# Altium project LVPM.PrjPcb
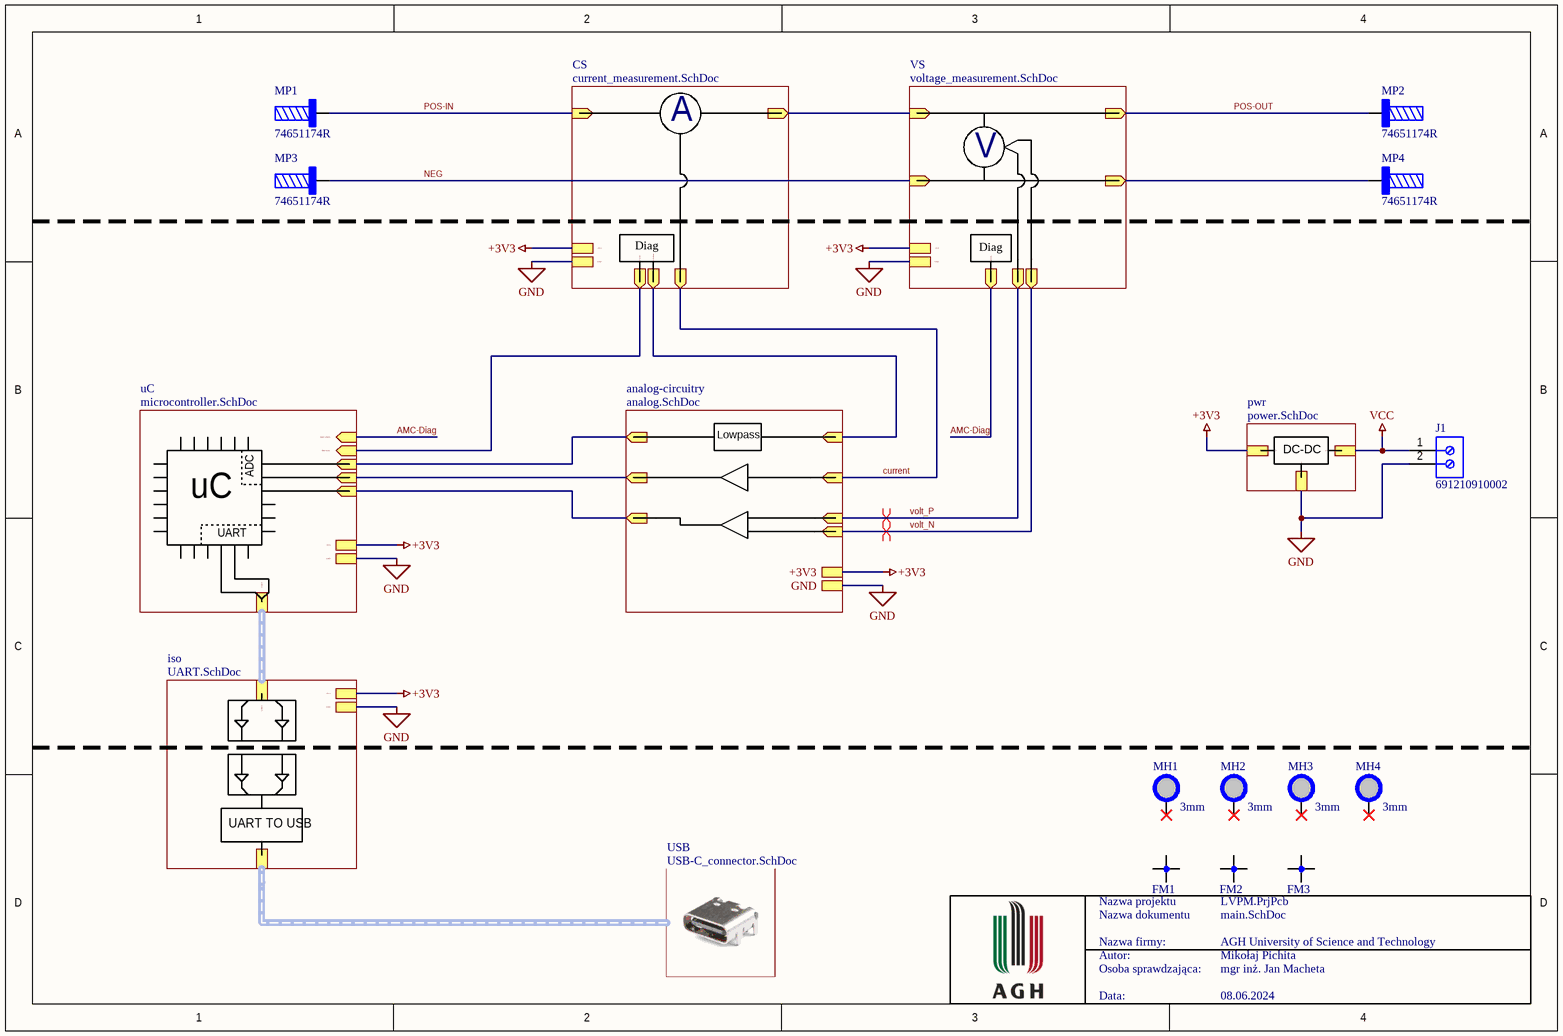
[diagram p0: main.SchDoc]
8 sheets, 108 parts. Net scope: strictly hierarchical (ports join the sheet entries above them; power ports are local).
Board file: PCB1.PcbDoc
Sheets:
  main.SchDoc
    CS = current_measurement.SchDoc
    VS = voltage_measurement.SchDoc
    uC = microcontroller.SchDoc
    iso = UART.SchDoc
    pwr = power.SchDoc
    USB = USB-C_connector.SchDoc
    analog-circuitry = analog.SchDoc

## Sheet main.SchDoc
size A4; Date: 08.06.2024; ApprovedBy: mgr inż. Jan Macheta; Author: Mikołaj Pichita; CompanyName: AGH University of Science and Technology; SheetNumber: 1; SheetTotal: 8

### Parts
FM1  *  [FIDUCIAL_MARKER]  (value not drawn)
FM2  *  [FIDUCIAL_MARKER]  (value not drawn)
FM3  *  [FIDUCIAL_MARKER]  (value not drawn)
J1  691210910002  [691210910002]
MH1  3mm  [MountingHole]  (no BOM)
MH2  3mm  [MountingHole]  (no BOM)
MH3  3mm  [MountingHole]  (no BOM)
MH4  3mm  [MountingHole]  (no BOM)
MP1  74651174R  [74651174]
MP2  74651174R  [74651174]
MP3  74651174R  [74651174]
MP4  74651174R  [74651174]

### Sub-sheets
analog-circuitry = analog.SchDoc: +3V3, GND, Voltage (out), Current (out), Alert-Filtered (out), TMCS-Alert (in), v_P (in), v_N (in), sensor_current (in)
CS = current_measurement.SchDoc: +IN (in), +OUT (out), GND, current (out), +3V3, TMCS-OC (out), TMCS-Alert (out)
iso = UART.SchDoc: UART (harness UART), USB (harness *), +3V3, GND
pwr = power.SchDoc: VCC, GND, +3V3
uC = microcontroller.SchDoc: GND, +3V3, AMC-DIAG (in), UART (harness UART), ADC-IN7 (in), ADC-IN9 (in), ADC-IN0 (in), TMCS-OC (in)
USB = USB-C_connector.SchDoc: USB (harness *)
VS = voltage_measurement.SchDoc: +IN (in), -IN (in), +OUT (out), -OUT (out), GND, +3V3, voltageP (out), voltageN (out), diagnostic (out)

### Nets
+3V3: sheet CS/+3V3, sheet VS/+3V3, sheet uC/+3V3, sheet iso/+3V3, sheet pwr/+3V3, sheet analog-circuitry/+3V3
GND: J1.2 ; sheet CS/GND, sheet VS/GND, sheet uC/GND, sheet iso/GND, sheet pwr/GND, sheet analog-circuitry/GND
VCC: J1.1 ; sheet pwr/VCC
Alert: sheet CS/TMCS-Alert, sheet analog-circuitry/TMCS-Alert
Alert-Fltr: sheet uC/ADC-IN0, sheet analog-circuitry/Alert-Filtered
AMC-Diag: sheet VS/diagnostic, sheet uC/AMC-DIAG
current: sheet CS/current, sheet analog-circuitry/sensor_current
in-curr: sheet uC/ADC-IN7, sheet analog-circuitry/Current
in-volt: sheet uC/ADC-IN9, sheet analog-circuitry/Voltage
NEG: MP3.1 MP4.1 ; sheet VS/-IN, sheet VS/-OUT
OC: sheet CS/TMCS-OC, sheet uC/TMCS-OC
POS-IN: MP1.1 ; sheet CS/+IN
POS-OUT: MP2.1 ; sheet CS/+OUT, sheet VS/+IN, sheet VS/+OUT
volt_N: sheet VS/voltageN, sheet analog-circuitry/v_N
volt_P: sheet VS/voltageP, sheet analog-circuitry/v_P

Not connected (* = marked no-connect by the designer): MH1 1*; MH2 1*; MH3 1*; MH4 1*

### Buses and harness runs
harness sheet iso/UART = sheet uC/UART
harness sheet iso/USB = sheet USB/USB

### Layout directives
differential pair: volt_N, volt_P

### Notes on the sheet
- A
- V
- Diag
- Lowpass
- uC
- ADC
- DC-DC
- UART
- UART TO USB
- Nazwa projektu
- Nazwa dokumentu
- Nazwa firmy:
- Autor:
- Osoba sprawdzająca:
- Data:

### Library data of the parts
FM1-FM3 = Fiducial marker: Value: *; HelpURL: *; MPN: *; Supplier: *; SupplierPartNumber: *
J1 = 691210910002: NexarPartId: 105950649; Current Rating: 6A; Voltage Rating: 150V; Number of Contacts: 2; Number of Rows: 1; Contact Material: Tin; Height: 8.7mm; Max Operating Temperature: 105°C; Min Operating Temperature: -40°C
MH1-MH4 = Mounting hole: Value: *; HelpURL: *; MPN: *; Supplier: *; SupplierPartNumber: *
MP1-MP4 = 74651174R: 74651174R Shank, THR, external thread, 7mm W x 8.5mm H, M4, 4 Pins | Wurth Electronics 74651174R; NexarPartId: 78872243; Current Rating: 50A; Material: Brass; Packaging: Tape and Reel; Height: 8.5mm; Max Operating Temperature: 150°C; RoHS: Compliant; Width: 7mm; Min Operating Temperature: -55°C; Number of Pins: 4

## Sheet current_measurement.SchDoc
size A4; Date: 08.06.2024; ApprovedBy: Jan Macheta; Author: Mikołaj Pichita; SheetNumber: 2; SheetTotal: 8
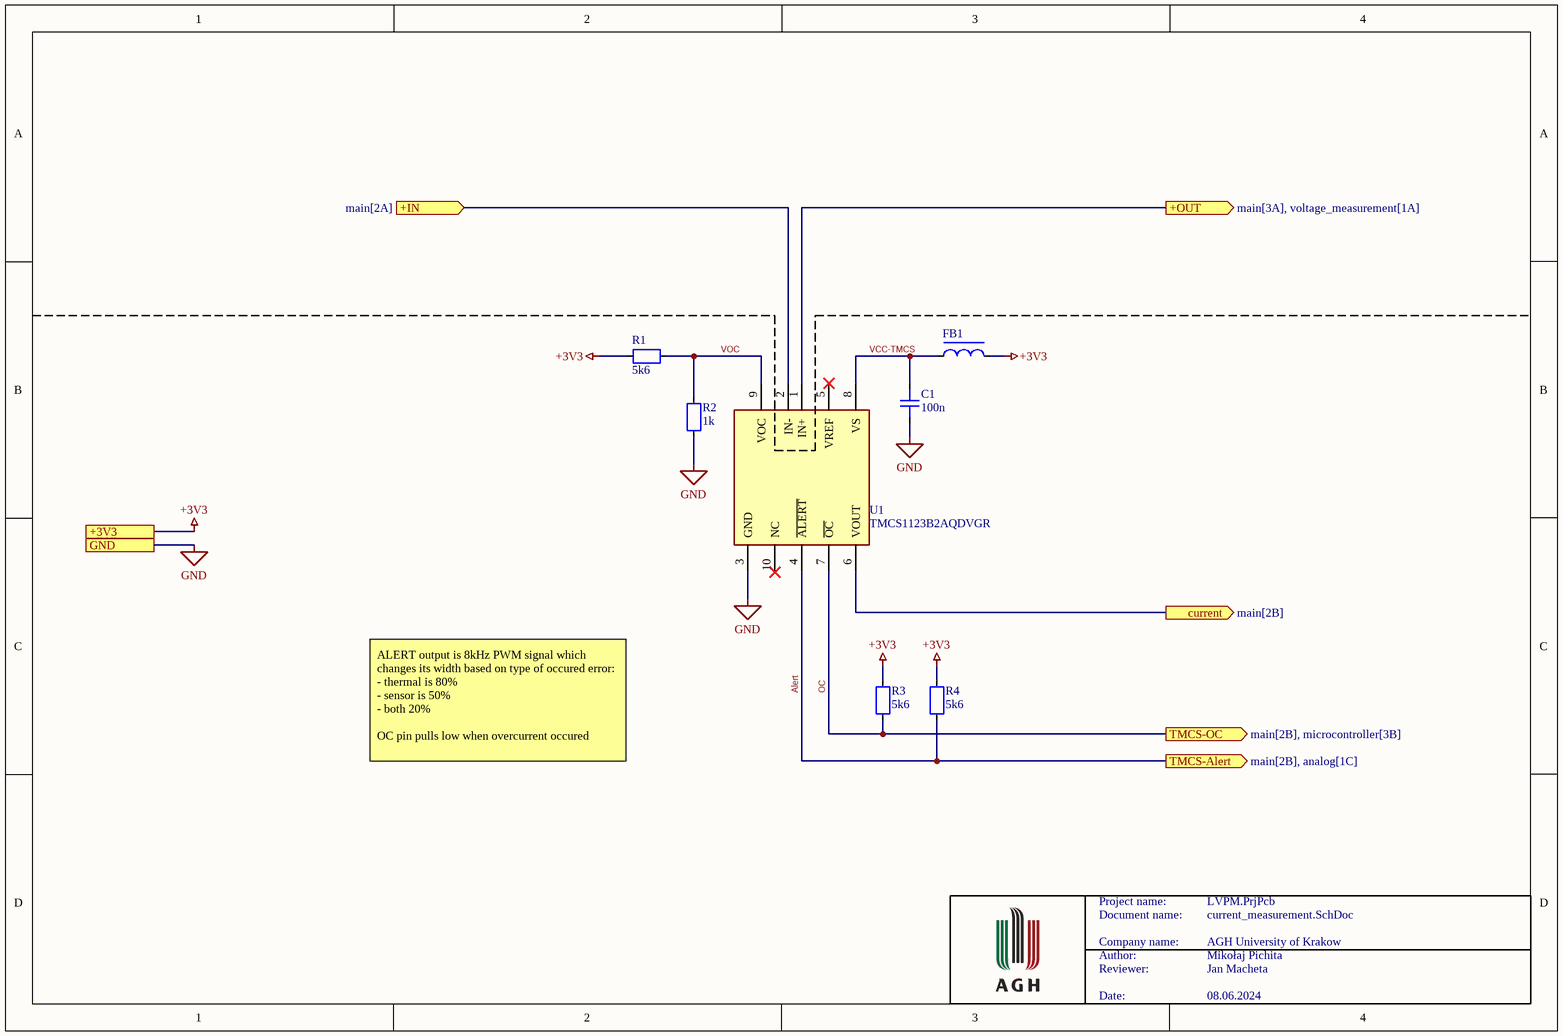
[diagram p1: current_measurement.SchDoc]

### Parts
C1  100n  [CAP0603]
FB1  *  [FB0402]  (value not drawn)
R1  5k6  [RES0603]
R2  1k  [RES0603]
R3  5k6  [RES0603]
R4  5k6  [RES0603]
U1  TMCS1123B2AQDVGR  [FP-DVG0010A-MFG]

### Ports
+3V3 (see main[2A], analog[4A], microcontroller[4A], power[2A], UART[1A], voltage_measurement[4D]), +IN (in, see main[2A]), +OUT (out, see main[3A], voltage_measurement[1A]), current (out, see main[2B]), GND (see main[2B], analog[4A], microcontroller[4A], power[2B], UART[1A], voltage_measurement[4D]), TMCS-Alert (out, see main[2B], analog[1C]), TMCS-OC (out, see main[2B], microcontroller[3B])

### Nets
+3V3: FB1.2 R1.2 R3.1 R4.1 ; port +3V3
GND: C1.2 R2.2 U1.3(GND) ; port GND
Alert: R4.2 U1.4(~{ALERT}) ; port TMCS-Alert
current: U1.6(VOUT) ; port current
OC: R3.2 U1.7(~{OC}) ; port TMCS-OC
POS-IN: U1.2(IN-) ; port +IN
POS-OUT: U1.1(IN+) ; port +OUT
VCC-TMCS: C1.1 FB1.1 U1.8(VS)
VOC: R1.1 R2.1 U1.9(VOC)

Not connected (* = marked no-connect by the designer): U1 5(VREF)* 10(NC)*

### Notes on the sheet
- ALERT output is 8kHz PWM signal which changes its width based on type of occured error:
  - thermal is 80%
  - sensor is 50%
  - both 20%
  OC pin pulls low when overcurrent occured
- Project name:
- Document name:
- Company name:
- Author:
- Reviewer:
- AGH University of Krakow
- Date:

### Library data of the parts
C1 = Capacitor: Value: *; HelpURL: *; MPN: *; Supplier: *; SupplierPartNumber: *
FB1 = Ferrite Bead: Value: *; HelpURL: *; MPN: *; Supplier: *; SupplierPartNumber: *
R1-R4 = Resistor: Value: *; HelpURL: *; MPN: *; Supplier: *; SupplierPartNumber: *
U1 = TMCS1123B2AQDVGR: TMCS1123B2AQDVGR ±1300V reinforced isolation, 80Arms 250kHz Hall-effect current sensor with AFR, reference and ALERT 10-SOIC -40 to 125; NexarPartId: 145718629; Manufacturer Lifecycle Status: ACTIVE; Max Junction Temperature (Tj): 165°C; Max Supply Voltage: 5.5V; Operating Supply Current: 11mA; Sensing Method: Hall Effect; Coil Resistance: 700µΩ; Min Supply Voltage: 3V; Accuracy: 0.1%; Lifecycle Status: Production; Height: 0m; Length: 10.3mm; Number of Pins: 10; Min Operating Temperature: -40°C; Thickness: 2.35mm; Width: 7.5mm; Case/Package: SOIC; Max Operating Temperature: 125°C; Ambient Temperature Range High: 125°C

## Sheet voltage_measurement.SchDoc
size A4; Date: 08.06.2024; ApprovedBy: Jan Macheta; Author: Mikołaj Pichita; SheetNumber: 3; SheetTotal: 8
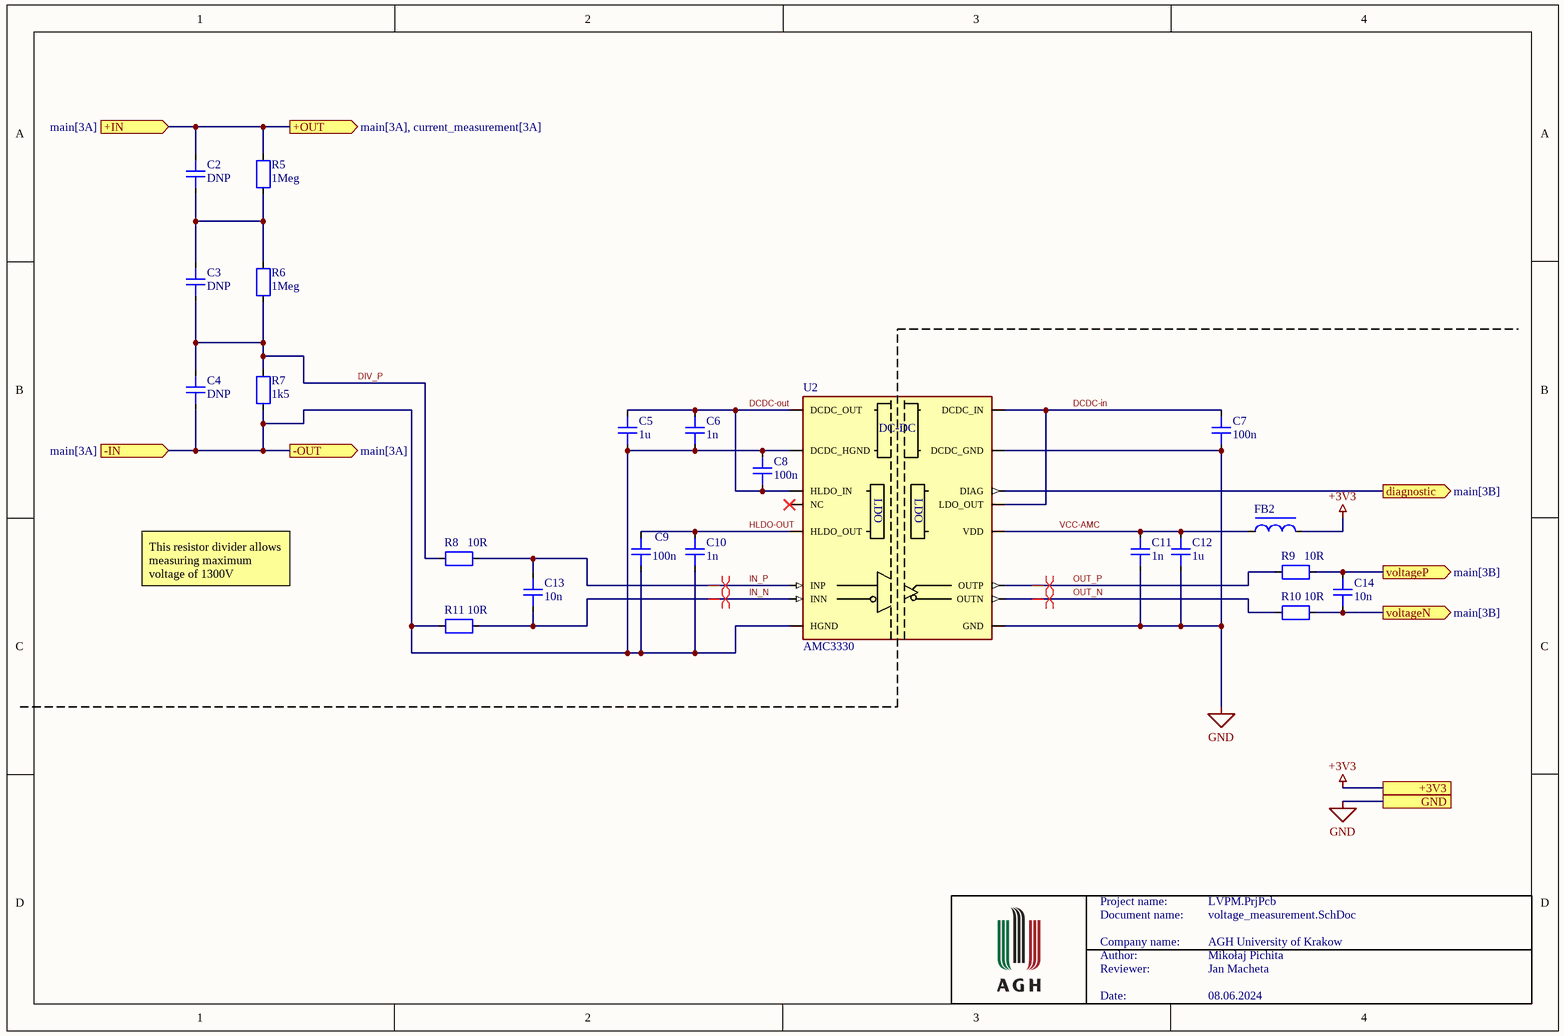
[diagram p2: voltage_measurement.SchDoc]

### Parts
C2  DNP  [CAP1206]
C3  DNP  [CAP1206]
C4  DNP  [CAP1206]
C5  1u  [CAP0603]
C6  1n  [CAP0603]
C7  100n  [CAP0603]
C8  100n  [CAP0603]
C9  100n  [CAP1206]
C10  1n  [CAP1206]
C11  1n  [CAP1206]
C12  1u  [CAP1206]
C13  10n  [CAP0603]
C14  10n  [CAP0603]
FB2  *  [FB0402]  (value not drawn)
R5  1Meg  [RESC3215X06N]
R6  1Meg  [RESC3215X06N]
R7  1k5  [RESC3215X06N]
R8  10R  [RES0603]
R9  10R  [RES0603]
R10  10R  [RES0603]
R11  10R  [RES0603]
U2  AMC3330  [SOIC127P1030X265-16N]

### Ports
+3V3 (see main[3A], analog[4A], current_measurement[1C], microcontroller[4A], power[2A], UART[1A]), +IN (in, see main[3A]), +OUT (out, see main[3A], current_measurement[3A]), -IN (in, see main[3A]), -OUT (out, see main[3A]), diagnostic (out, see main[3B]), GND (see main[3B], analog[4A], current_measurement[1C], microcontroller[4A], power[2B], UART[1A]), voltageN (out, see main[3B]), voltageP (out, see main[3B])

### Nets
+3V3: FB2.2 ; port +3V3
GND: C7.2 C11.2 C12.2 U2.9(GND) U2.15(DCDC_GND) ; port GND
AMC-Diag: U2.14(DIAG) ; port diagnostic
DCDC-in: C7.1 U2.13(LDO_OUT) U2.16(DCDC_IN)
DCDC-out: C5.1 C6.1 C8.2 U2.1(DCDC_OUT) U2.3(HLDO_IN)
DIV_P: C3.2 C4.1 R6.2 R7.1 R8.1
HLDO-OUT: C9.1 C10.1 U2.5(HLDO_OUT)
IN_N: C13.2 R11.2 U2.7(INN)
IN_P: C13.1 R8.2 U2.6(INP)
NEG: C4.2 C5.2 C6.2 C8.1 C9.2 C10.2 R7.2 R11.1 U2.2(DCDC_HGND) U2.8(HGND) ; port -IN, port -OUT
OUT_N: R10.2 U2.10(OUTN)
OUT_P: R9.2 U2.11(OUTP)
POS-OUT: C2.1 R5.1 ; port +IN, port +OUT
VCC-AMC: C11.1 C12.1 FB2.1 U2.12(VDD)
volt_N: C14.1 R10.1 ; port voltageN
volt_P: C14.2 R9.1 ; port voltageP
NetC2_2: C2.2 C3.1 R5.2 R6.1

Not connected (* = marked no-connect by the designer): U2 4(NC)*

### Layout directives
differential pair: IN_N, IN_P, OUT_N, OUT_P

### Notes on the sheet
- This resistor divider allows measuring maximum voltage of 1300V
- Project name:
- Document name:
- Company name:
- Author:
- Reviewer:
- AGH University of Krakow
- Date:
- (in symbol AMC3330) DC-DC; LDO

### Library data of the parts
C2-C14 = Capacitor: Value: *; HelpURL: *; MPN: *; Supplier: *; SupplierPartNumber: *
  C5 C12: Supplier 1: Mouser; Supplier Part Number 1: 581-12065C105K4Z4A
  C6 C10: Supplier 1: Mouser; Supplier Part Number 1: 581-0603YC102J4T2A
  C7-C9: Supplier 1: Mouser; Supplier Part Number 1: 581-06035C104KAT2A
  C11: Supplier 1: Mouser; Supplier Part Number 1: 581-1206GC102KAT3A
  C14: Supplier 1: Mouser; Supplier Part Number 1: 581-06035C103K
FB2 = Ferrite Bead: Value: *; HelpURL: *; MPN: *; Supplier: *; SupplierPartNumber: *
R5-R11 = Resistor: Value: *; HelpURL: *; MPN: *; Supplier: *; SupplierPartNumber: *
  R9 R10: Supplier 1: Mouser; Supplier Part Number 1: 603-RP0603BRD0710RL
U2 = AMC3330: ±1-V input, precision voltage sensing reinforced isolated amplifier with integrated DC/DC; Value: *; HelpURL: *; MPN: *; Supplier: *; SupplierPartNumber: *

## Sheet microcontroller.SchDoc
size A4; Date: 08.06.2024; ApprovedBy: Jan Macheta; Author: Mikołaj Pichita; SheetNumber: 5; SheetTotal: 8
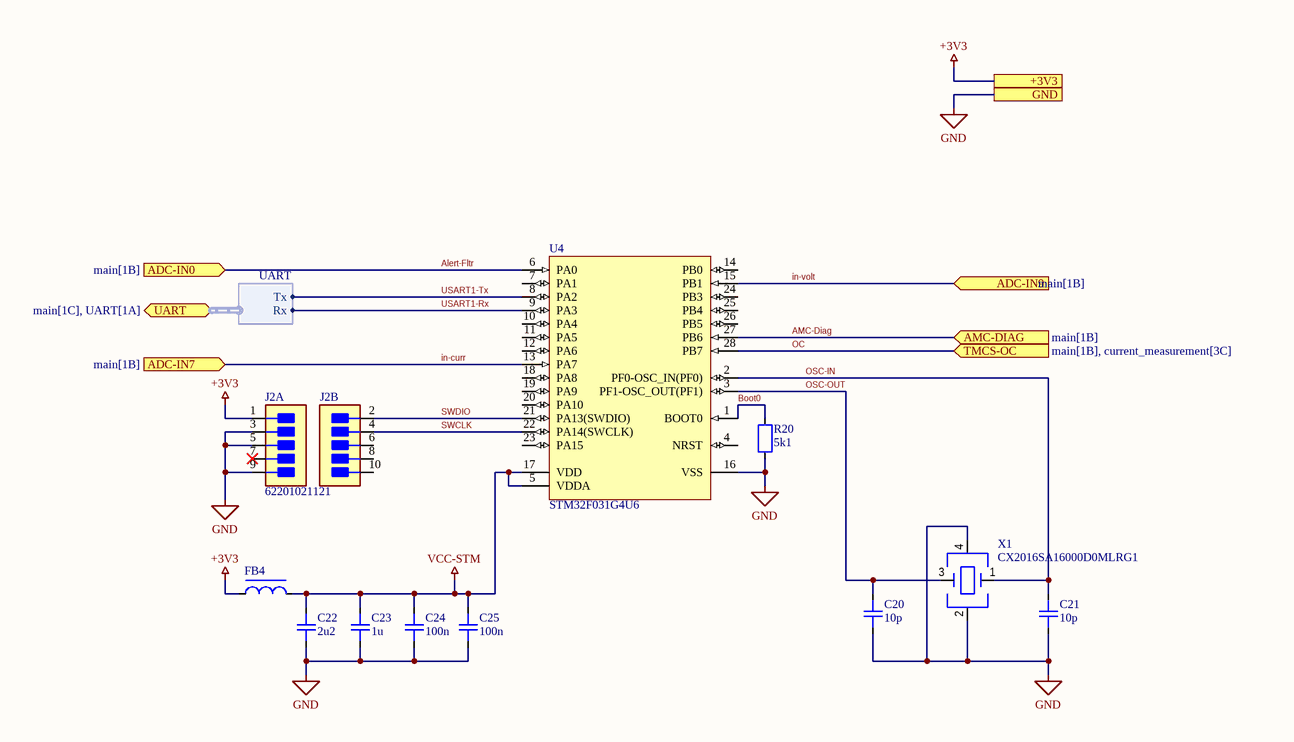
[diagram p3: microcontroller.SchDoc]

### Parts
C20  10p  [CAP0603]
C21  10p  [CAP0603]
C22  2u2  [CAP0603]
C23  1u  [CAP0603]
C24  100n  [CAP0204]
C25  100n  [CAP0204]
FB4  *  [FB0402]  (value not drawn)
J2  62201021121  [62201021121]  (parts A,B of 2)
R20  5k1  [RES0603]
U4  STM32F031G4U6  [STM-UFQFPN28_V]
X1  CX2016SA16000D0MLRG1  [CX2016]

### Ports
+3V3 (see main[1C], analog[4A], current_measurement[1C], power[2A], UART[1A], voltage_measurement[4D]), ADC-IN0 (in, see main[1B]), ADC-IN7 (in, see main[1B]), ADC-IN9 (in, see main[1B]), AMC-DIAG (in, see main[1B]), GND (see main[1C], analog[4A], current_measurement[1C], power[2B], UART[1A], voltage_measurement[4D]), TMCS-OC (in, see main[1B], current_measurement[3C]), UART (bidir, harness UART, see main[1C], UART[1A])

### Harnesses
UART: Tx, Rx

### Nets
+3V3: FB4.1 J2.1 ; port +3V3
GND: C20.2 C21.2 C22.2 C23.2 C24.2 C25.2 J2.3 J2.5 J2.9 R20.2 U4.16(VSS) X1.2 X1.4 ; port GND
VCC-STM: C22.1 C23.1 C24.1 C25.1 FB4.2 U4.5(VDDA) U4.17(VDD)
Alert-Fltr: U4.6(PA0) ; port ADC-IN0
AMC-Diag: U4.27(PB6) ; port AMC-DIAG
Boot0: R20.1 U4.1(BOOT0)
in-curr: U4.13(PA7) ; port ADC-IN7
in-volt: U4.15(PB1) ; port ADC-IN9
OC: U4.28(PB7) ; port TMCS-OC
OSC-IN: C21.1 U4.2(PF0-OSC_IN(PF0)) X1.1
OSC-OUT: C20.1 U4.3(PF1-OSC_OUT(PF1)) X1.3
SWCLK: J2.4 U4.22(PA14(SWCLK))
SWDIO: J2.2 U4.21(PA13(SWDIO))
USART1-Rx: U4.9(PA3) ; port UART.Rx
USART1-Tx: U4.8(PA2) ; port UART.Tx

Not connected (* = marked no-connect by the designer): J2 6 7* 8 10; U4 4(NRST) 7(PA1) 10(PA4) 11(PA5) 12(PA6) 14(PB0) 18(PA8) 19(PA9) 20(PA10) 23(PA15) 24(PB3) 25(PB4) 26(PB5)

### Notes on the sheet
- Project name:
- Document name:
- Company name:
- Author:
- Reviewer:
- AGH University of Krakow
- Date:

### Library data of the parts
C20-C25 = Capacitor: Value: *; HelpURL: *; MPN: *; Supplier: *; SupplierPartNumber: *
FB4 = Ferrite Bead: Value: *; HelpURL: *; MPN: *; Supplier: *; SupplierPartNumber: *
J2 = 62201021121: CONN HEADER VERT 10POS 1.27MM; Contact Post Length: 0.12inch; Selectively Loaded: No (Without); High Speed Serial Data Connector: No; Contact Current Rating: 3A; Approvals: CSA; Voltage Rating: 750V; Number of Positions: 14; PCB Mount Retention: Without; High Temperature Housing: Yes; Connector Type: Plug; Pitch: 2.54mm; Insulation Resistance: 5GR; PCB Thickness: 0.062inch; PCB Mounting Orientation: Vertical; Board Standoff: Yes (With); Housing Material: Thermoplastic; Series: AMPMODU MOD II; Length: 17.37mm; Contact Material: Bronze; Stabilizers: No (Without); Gasket: No (Without); Depth: 4.88mm; Contact Gender: Male; Current Rating: 3A; ELV: Compliant; Packaging: Carton; Contact Plating: Gold; Color: Black; Package Quantity: 200; Contact Protection: No (Without); Contact Type: Male Pin; Mount: Through Hole; Strain Relief: No (Without); Flammability Rating: UL94 V-0; Max Operating Temperature: 105°C; Radiation Hardening: No; Row Spacing: 2.54mm; Mating Connector Lock: No (Without); RoHS Compliant: Yes; Keyed: No; Mating Alignment: No (Without); Contact Mating Length: 0.23inch; Number of Rows: 2; Number of Contacts: 14; Housing Color: Black; Lead Free: Lead Free; Orientation: Straight; Termination: Through Hole; Min Operating Temperature: -65°C; Contact Shape: Square
R20 = Resistor: Value: *; HelpURL: *; MPN: *; Supplier: *; SupplierPartNumber: *
U4 = STM32F031G4U6: ARM Cortex-M0 32-bit MCU, 16 KB Flash, 4 KB Internal RAM, 23 I/Os, 28-Pin UFQFPN, -40 to 85 degC, Tray; FLASH Size (Prog) (kB): 16; Supply Voltage(Vcc) min (V): 2; I/Os (High Current): 23; Internal RAM Size (kB): 4; Operating Frequency(F) (Processor speed) (MHz): 48; Package Description: 28-Pin Ultra Thin Fine Pitch Quad Flat No-Lead, 4 x 4 x 0.6 mm Body, 0.5 mm Pitch; ComponentLink1URL: http://www.st.com/; Package Reference: UFQFPN28; ComponentLink1Description: Manufacturer URL; ComponentLink2Description: Datasheet; Packing: Tray; ComponentLink2URL: http://www.st.com/st-web-ui/static/active/en/resource/technical/document/datasheet/DM00104043.pdf; Core: ARM Cortex-M0; DatasheetVersion: Rev. 3; Mounting Technology: Surface Mount
X1 = CX2016SA16000D0MLRG1: Crystals 2.0mm x 1.6mm Crystal 16MHz 8pF +/-40ppm; Value: *; HelpURL: *; MPN: *; Supplier: *; SupplierPartNumber: *

## Sheet UART.SchDoc
size A4; Date: 08.06.2024; ApprovedBy: Jan Macheta; Author: Mikołaj Pichita; SheetNumber: 6; SheetTotal: 8
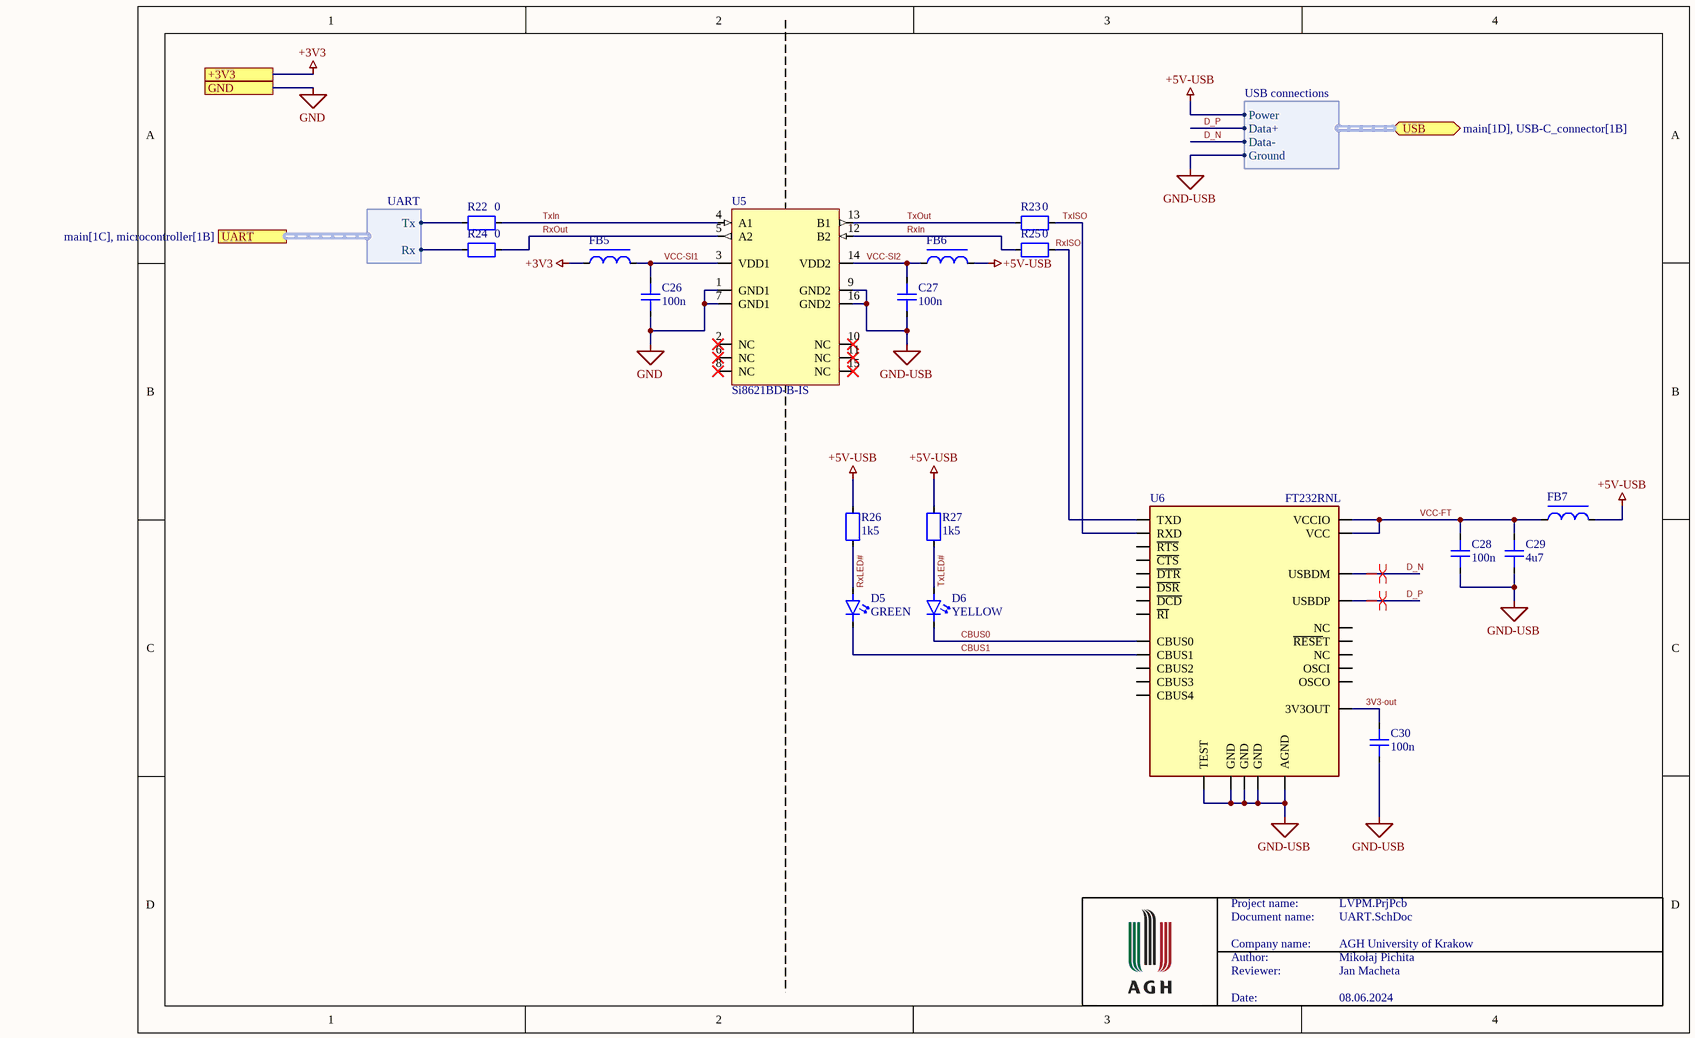
[diagram p4: UART.SchDoc]

### Parts
C26  100n  [CAP0603]
C27  100n  [CAP0603]
C28  100n  [CAP0603]
C29  4u7  [CAP0603]
C30  100n  [CAP0603]
D5  GREEN  [LED0603]
D6  YELLOW  [LED0603]
FB5  *  [FB0402]  (value not drawn)
FB6  *  [FB0402]  (value not drawn)
FB7  *  [FB0402]  (value not drawn)
R22  0  [RES0603]
R23  0  [RES0603]
R24  0  [RES0603]
R25  0  [RES0603]
R26  1k5  [RES0603]
R27  1k5  [RES0603]
U5  Si8621BD-B-IS  [SLAB-SOIC-16-WB_M]
U6  FT232RNL  [SOP65P780X200-28N]

### Ports
+3V3 (see main[1C], analog[4A], current_measurement[1C], microcontroller[4A], power[2A], voltage_measurement[4D]), GND (see main[1C], analog[4A], current_measurement[1C], microcontroller[4A], power[2B], voltage_measurement[4D]), UART (harness UART, see main[1C], microcontroller[1B]), USB (bidir, harness USB connections, see main[1D], USB-C_connector[1B])

### Harnesses
UART: Tx, Rx
USB connections: Power, Data+, Data-, Ground

### Nets
+3V3: FB5.1 ; port +3V3
+5V-USB: FB6.2 FB7.2 R26.1 R27.1 ; port USB.Power
GND: C26.2 U5.1(GND1) U5.7(GND1) ; port GND
GND-USB: C27.2 C28.2 C29.2 C30.2 U5.9(GND2) U5.16(GND2) U6.7(GND) U6.18(GND) U6.21(GND) U6.25(AGND) U6.26(TEST) ; port USB.Ground
3V3-out: C30.1 U6.17(3V3OUT)
CBUS0: D6.2 U6.23(CBUS0)
CBUS1: D5.2 U6.22(CBUS1)
D_N: U6.16(USBDM) ; port USB.Data-
D_P: U6.15(USBDP) ; port USB.Data+
RxIn: R25.2 U5.12(B2)
RxISO: R25.1 U6.1(TXD)
RxLED#: D5.1 R26.2
RxOut: R24.1 U5.5(A2)
TxIn: R22.1 U5.4(A1)
TxISO: R23.1 U6.5(RXD)
TxLED#: D6.1 R27.2
TxOut: R23.2 U5.13(B1)
USART1-Rx: R24.2 ; port UART.Rx
USART1-Tx: R22.2 ; port UART.Tx
VCC-FT: C28.1 C29.1 FB7.1 U6.4(VCCIO) U6.20(VCC)
VCC-SI1: C26.1 FB5.2 U5.3(VDD1)
VCC-SI2: C27.1 FB6.1 U5.14(VDD2)

Not connected (* = marked no-connect by the designer): U5 2(NC)* 6(NC)* 8(NC)* 10(NC)* 11(NC)* 15(NC)*; U6 2(~{DTR}) 3(~{RTS}) 6(~{RI}) 8(NC) 9(~{DSR}) 10(~{DCD}) 11(~{CTS}) 12(CBUS4) 13(CBUS2) 14(CBUS3) 19(~{RESE}T) 24(NC) 27(OSCI) 28(OSCO)

### Layout directives
differential pair: D_N, D_P

### Notes on the sheet
- Project name:
- Document name:
- Company name:
- Author:
- Reviewer:
- AGH University of Krakow
- Date:

### Library data of the parts
C26-C30 = Capacitor: Value: *; HelpURL: *; MPN: *; Supplier: *; SupplierPartNumber: *
D5 D6 = LED: Value: *; HelpURL: *; MPN: *; Supplier: *; SupplierPartNumber: *
FB5-FB7 = Ferrite Bead: Value: *; HelpURL: *; MPN: *; Supplier: *; SupplierPartNumber: *
R22-R27 = Resistor: Value: *; HelpURL: *; MPN: *; Supplier: *; SupplierPartNumber: *
U5 = Si8621BD-B-IS: Low-Power Single and Dual-Channel Digital Isolator, 150 Mbps, 5 kVRMS Isolation Rating, -40 to 125 degC, 16-pin SOIC; Manufacturer: Silicon Labs; Maximum Propagation Delay (ns): 13; Maximum Data Rate (Mbps): 150; Channel Type: Unidirectional; Enable Control: TRUE; AEC-Q100: FALSE; Sub-Family: Isolators; Isolation Rating (kV): 5; ComponentLink1URL: http://www.silabs.com/; ComponentLink2Description: Datasheet; ComponentLink1Description: Manufacturer URL; Mounting Technology: Surface Mount; Code_JEDEC: MS-013; 10kV surge: FALSE; ComponentLink3Description: Package Specification; PackageReference: SOIC-16-WB; ComponentLink2URL: http://www.silabs.com/Support%20Documents/TechnicalDocs/Si861x-2x.pdf; ComponentLink3URL: https://www.silabs.com/Support%20Documents/TechnicalDocs/Si823x.pdf; DatasheetVersion: Rev. 1.3; PartNumber: Si8621BD-B-IS; PackageDescription: 16-Pin Wide Body Plastic Small Outline, Body 10.3 x 7.5 mm, Pitch 1.27 mm
U6 = FT232RNL: USB Interface IC USB Full Speed to Serial UART IC, Includes Oscillator and EEPROM, SSOP-28; Value: *; HelpURL: *; MPN: *; Supplier: *; SupplierPartNumber: *

## Sheet power.SchDoc
size A4; Date: 08.06.2024; ApprovedBy: Jan Macheta; Author: Mikołaj Pichita; SheetNumber: 8; SheetTotal: 8
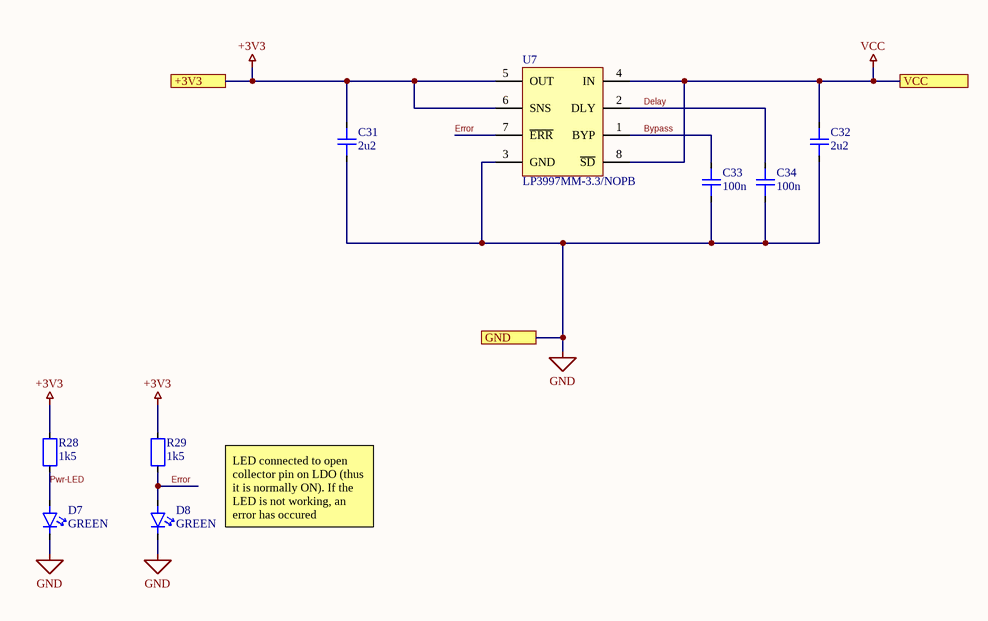
[diagram p5: power.SchDoc]

### Parts
C31  2u2  [CAP0603]
C32  2u2  [CAP0603]
C33  100n  [CAP0603]
C34  100n  [CAP0603]
D7  GREEN  [LED0603]
D8  GREEN  [LED0603]
R28  1k5  [RES0603]
R29  1k5  [RES0603]
U7  LP3997MM-3.3/NOPB  [DGK0008A_N]

### Ports
+3V3 (see main[4B], analog[4A], current_measurement[1C], microcontroller[4A], UART[1A], voltage_measurement[4D]), GND (see main[4B], analog[4A], current_measurement[1C], microcontroller[4A], UART[1A], voltage_measurement[4D]), VCC (see main[4B])

### Nets
+3V3: C31.1 R28.1 R29.1 U7.5(OUT) U7.6(SNS) ; port +3V3
GND: C31.2 C32.2 C33.2 C34.2 D7.2 D8.2 U7.3(GND) ; port GND
VCC: C32.1 U7.4(IN) U7.8(~{SD}) ; port VCC
Bypass: C33.1 U7.1(BYP)
Delay: C34.1 U7.2(DLY)
Error: D8.1 R29.2 U7.7(~{ERR})
Pwr-LED: D7.1 R28.2

### Notes on the sheet
- LED connected to open collector pin on LDO (thus it is normally ON). If the LED is not working, an error has occured
- Project name:
- Document name:
- Company name:
- Author:
- Reviewer:
- AGH University of Krakow
- Date:

### Library data of the parts
C31-C34 = Capacitor: Value: *; HelpURL: *; MPN: *; Supplier: *; SupplierPartNumber: *
D7 D8 = LED: Value: *; HelpURL: *; MPN: *; Supplier: *; SupplierPartNumber: *
R28 R29 = Resistor: Value: *; HelpURL: *; MPN: *; Supplier: *; SupplierPartNumber: *
U7 = LP3997MM-3.3/NOPB: Micropower 250mA CMOS LDO Regulator with Error Flag / Power-On-Reset, 8-pin Mini SOIC, Pb-Free; Manufacturer: Texas Instruments; CompType: LDO IC; PowerWise: N; PackageTopMarking: ZXTT*SAKB; ComponentLink1URL: http://www.ti.com/general/docs/lit/getliterature.tsp?genericPartNumber=LP3997&fileType=pdf; ComponentLink1Description: Datasheet URL; PackageReference: DGK0008A; PinCount: 8; RoHS: Y; Code_JEDEC: MO-187-AA; PackageDescription: MINI SOIC, .118 x .118 x .034in, 8 Lead, .0256in Pitch

## Sheet USB-C_connector.SchDoc
size A4; Date: 08.06.2024; ApprovedBy: Jan Macheta; Author: Mikołaj Pichita; SheetNumber: 7; SheetTotal: 8
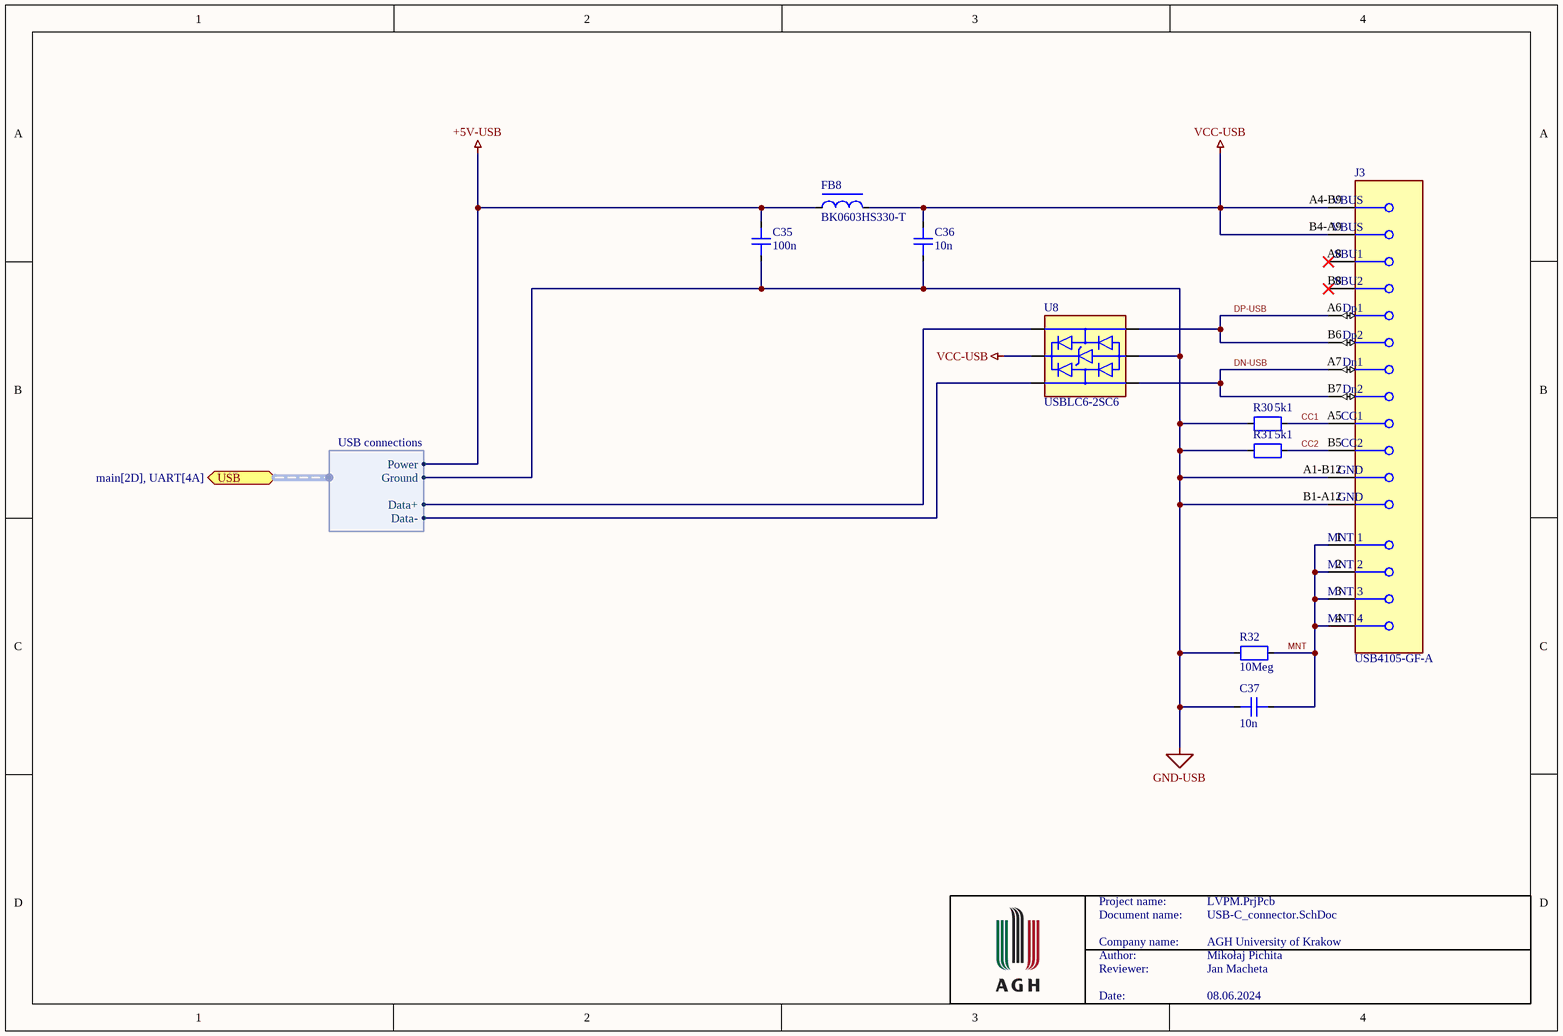
[diagram p6: USB-C_connector.SchDoc]

### Parts
C35  100n  [CAP0603]
C36  10n  [CAP0603]
C37  10n  [CAP0603]
FB8  BK0603HS330-T  [FB0402]
J3  USB4105-GF-A  [FP-USB4105-GF-A-MFG]
R30  5k1  [RES0603]
R31  5k1  [RES0603]
R32  10Meg  [RES0603]
U8  USBLC6-2SC6  [SOT95P280X145-6N]

### Ports
USB (bidir, harness USB connections, see main[2D], UART[4A])

### Harnesses
USB connections: Power, Data+, Data-, Ground

### Nets
+5V-USB: C35.1 FB8.1 ; port USB.Power
GND-USB: C35.2 C36.2 C37.2 J3.A1-B12(GND) J3.B1-A12(GND) R30.1 R31.1 R32.1 U8.2(GND) ; port USB.Ground
VCC-USB: C36.1 FB8.2 J3.A4-B9(VBUS) J3.B4-A9(VBUS) U8.5(VBUS)
CC1: J3.A5(CC1) R30.2
CC2: J3.B5(CC2) R31.2
D_N: U8.6(I/O1) ; port USB.Data-
D_P: U8.4(I/O2) ; port USB.Data+
DN-USB: J3.A7(Dn1) J3.B7(Dn2) U8.1(I/O1)
DP-USB: J3.A6(Dp1) J3.B6(Dp2) U8.3(I/O2)
MNT: C37.1 J3.1(MNT_1) J3.2(MNT_2) J3.3(MNT_3) J3.4(MNT_4) R32.2

Not connected (* = marked no-connect by the designer): J3 A8(SBU1)* B8(SBU2)*

### Notes on the sheet
- Project name:
- Document name:
- Company name:
- Author:
- Reviewer:
- AGH University of Krakow
- Date:

### Library data of the parts
C35-C37 = Capacitor: Value: *; HelpURL: *; MPN: *; Supplier: *; SupplierPartNumber: *
FB8 = Ferrite Bead: Value: *; HelpURL: *; MPN: *; Supplier: *; SupplierPartNumber: *
J3 = USB4105-GF-A: CONN RCPT USB2.0 TYPEC 5A; Manufacturer: GCT; Voltage Rating: 20V; Is Female: yes; Current Rating: 5/6.25/1.25/0.25A; Number Of Contacts: 16; Conn Orientation: Right Angle; Device Class L1: Connectors; Category: Conn; Lead Free: Yes; RoHS: TRUE; Temperature Range High: +85°C; Digikey Description: CONN RCPT USB2.0 TYPEC 5A; Device Class L3: unset; ComponentLink2Description: Datasheet; Manufacturer Part Number: USB4105-GF-A; Package: 0; Usb Standard: USB 2.0; Device Class L2: USB Connectors; Automotive: No; Temperature Range Low: -40°C; Height: 3.46mm; Temperature: -40°C to +85°C; Contact Material: Gold,Nickel; ComponentLink2URL: https://gct.co/files/drawings/usb4105.pdf; Octopart: https://octopart.com/usb4105-gf-a-gct-106627878
R30-R32 = Resistor: Value: *; HelpURL: *; MPN: *; Supplier: *; SupplierPartNumber: *
U8 = USBLC6-2SC6: Very low capacitance ESD protection; Value: *; HelpURL: *; MPN: *; Supplier: *; SupplierPartNumber: *

## Sheet analog.SchDoc
size A4; Date: 08.06.2024; ApprovedBy: Jan Macheta; Author: Mikołaj Pichita; SheetNumber: 4; SheetTotal: 8
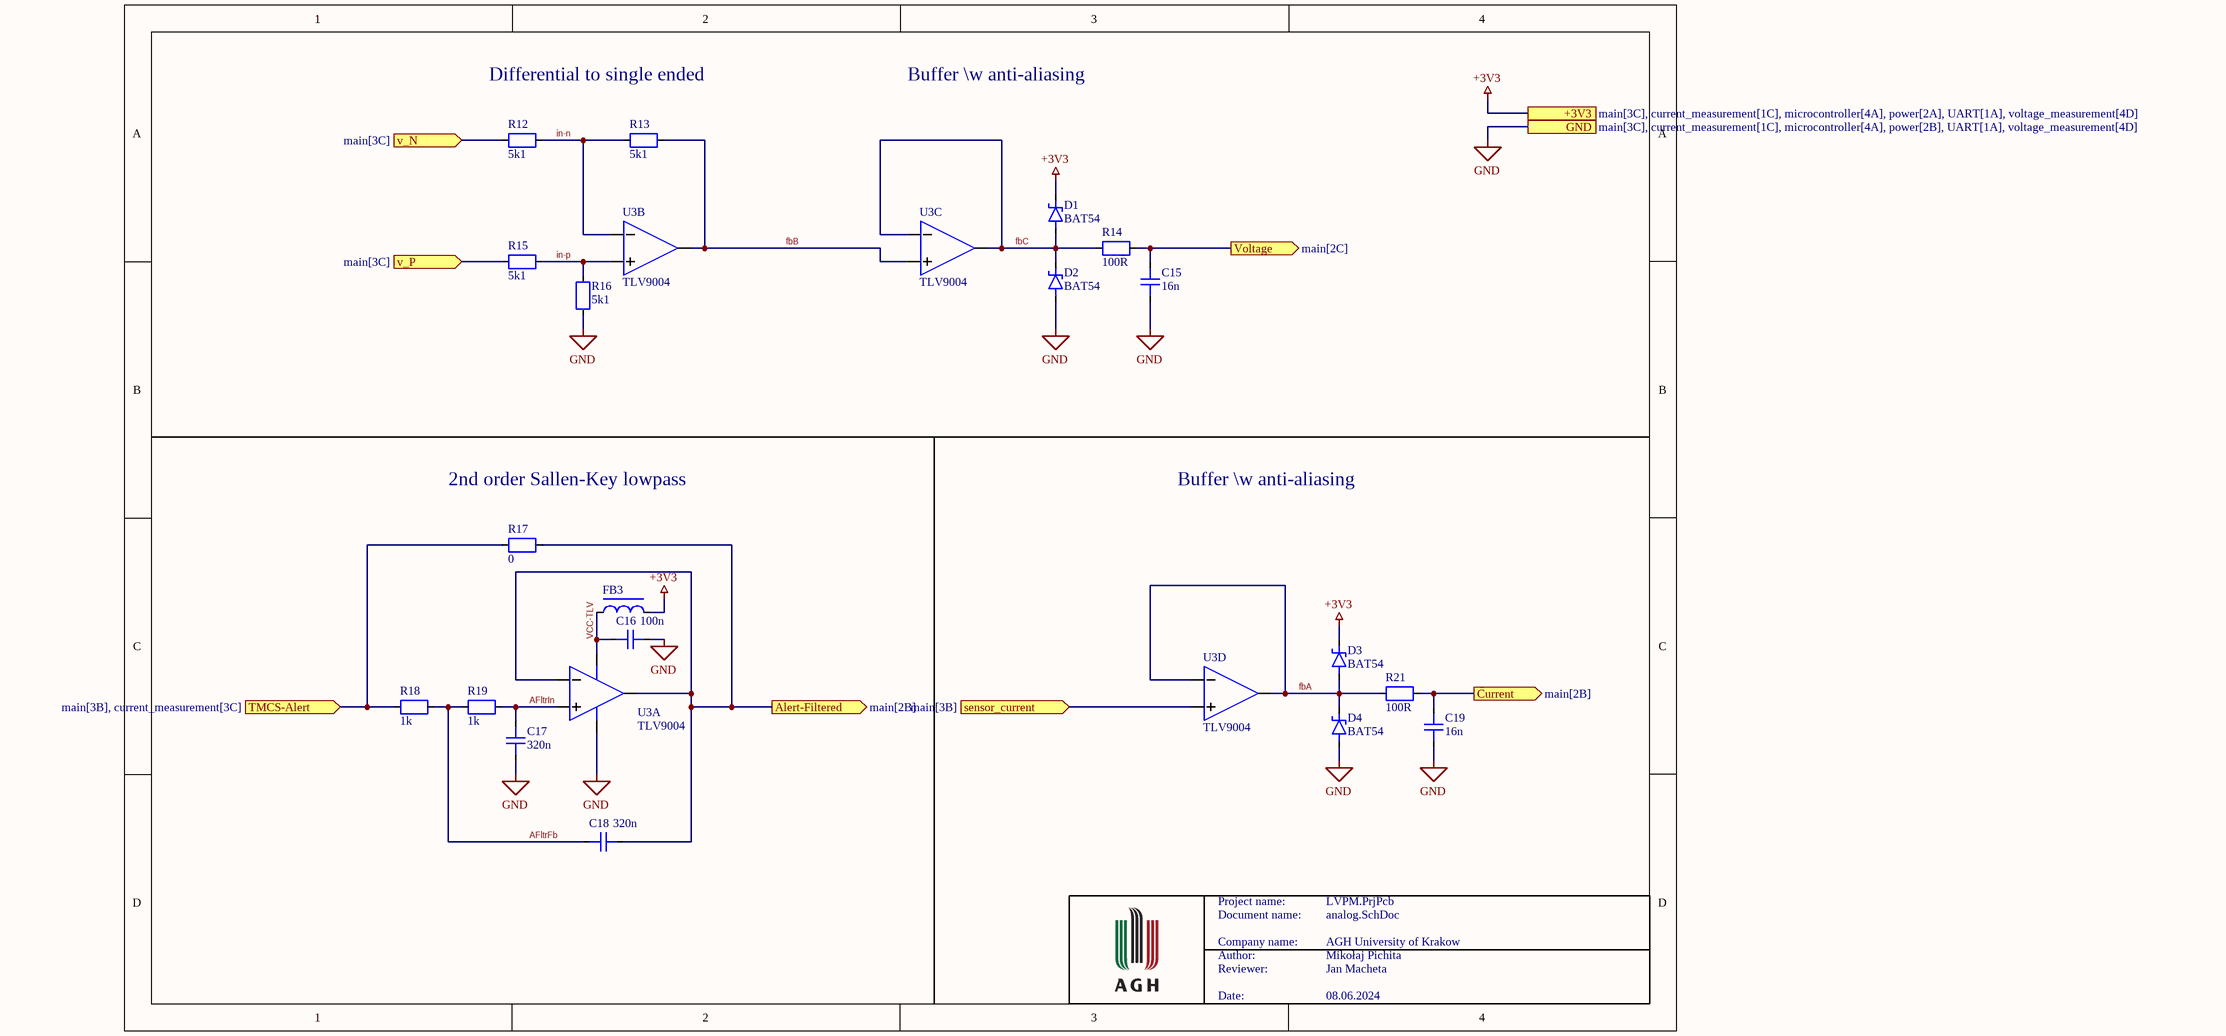
[diagram p7: analog.SchDoc]

### Parts
C15  16n  [CAP0603]
C16  100n  [CAP0603]
C17  320n  [CAP0603]
C18  320n  [CAP0603]
C19  16n  [CAP0603]
D1  BAT54  [INF-SC79_V]
D2  BAT54  [INF-SC79_V]
D3  BAT54  [INF-SC79_V]
D4  BAT54  [INF-SC79_V]
FB3  *  [FB0402]  (value not drawn)
R12  5k1  [RES0603]
R13  5k1  [RES0603]
R14  100R  [RES0603]
R15  5k1  [RES0603]
R16  5k1  [RES0603]
R17  0  [RES0603]
R18  1k  [RES0603]
R19  1k  [RES0603]
R21  100R  [RES0603]
U3  TLV9004  [TSSOP50P330X110-14N]  (parts A,B,C,D of 4)

### Ports
+3V3 (see main[3C], current_measurement[1C], microcontroller[4A], power[2A], UART[1A], voltage_measurement[4D]), Alert-Filtered (out, see main[2B]), Current (out, see main[2B]), GND (see main[3C], current_measurement[1C], microcontroller[4A], power[2B], UART[1A], voltage_measurement[4D]), sensor_current (in, see main[3B]), TMCS-Alert (in, see main[3B], current_measurement[3C]), v_N (in, see main[3C]), v_P (in, see main[3C]), Voltage (out, see main[2C])

### Nets
+3V3: D1.1(Cathode) D3.1(Cathode) FB3.2 ; port +3V3
GND: C15.2 C16.2 C17.2 C19.2 D2.2(Anode) D4.2(Anode) R16.2 U3.11(V-) ; port GND
AFltrFb: C18.1 R18.1 R19.2
AFltrIn: C17.1 R19.1 U3.3(IN1+)
Alert: R17.2 R18.2 ; port TMCS-Alert
Alert-Fltr: C18.2 R17.1 U3.1(OUT1) U3.2(IN1-) ; port Alert-Filtered
current: U3.12(IN4+) ; port sensor_current
fbA: D3.2(Anode) D4.1(Cathode) R21.2 U3.13(IN4-) U3.14(OUT4)
fbB: R13.2 U3.7(OUT2) U3.10(IN3+)
fbC: D1.2(Anode) D2.1(Cathode) R14.2 U3.8(OUT3) U3.9(IN3-)
in-curr: C19.1 R21.1 ; port Current
in-n: R12.2 R13.1 U3.6(IN2-)
in-p: R15.2 R16.1 U3.5(IN2+)
in-volt: C15.1 R14.1 ; port Voltage
VCC-TLV: C16.1 FB3.1 U3.4(V+)
volt_N: R12.1 ; port v_N
volt_P: R15.1 ; port v_P

### Notes on the sheet
- Differential to single ended
- Buffer \w anti-aliasing
- 2nd order Sallen-Key lowpass
- Project name:
- Document name:
- Company name:
- Author:
- Reviewer:
- AGH University of Krakow
- Date:

### Library data of the parts
C15-C19 = Capacitor: Value: *; HelpURL: *; MPN: *; Supplier: *; SupplierPartNumber: *
D1-D4 = Schottky: Value: *; HelpURL: *; MPN: *; Supplier: *; SupplierPartNumber: *
FB3 = Ferrite Bead: Value: *; HelpURL: *; MPN: *; Supplier: *; SupplierPartNumber: *
R12-R19 R21 = Resistor: Value: *; HelpURL: *; MPN: *; Supplier: *; SupplierPartNumber: *
U3 = TLV9004: Operational Amplifiers - Op Amps Quad, 5.5-V, 1-MHz, RRIO operational amplifier for cost-optimized applications 14-SOT-23-THIN -40 to 125; Value: *; HelpURL: *; MPN: *; Supplier: *; SupplierPartNumber: *

## Nets that join several sheets
+3V3: current_measurement (FB1.2 R1.2 R3.1 R4.1), voltage_measurement (FB2.2), microcontroller (FB4.1 J2.1), UART (FB5.1), power (5 pins), analog (D1.1 D3.1 FB3.2)
+5V-USB: UART (FB6.2 FB7.2 R26.1 R27.1), USB-C_connector (C35.1 FB8.1)
GND: main (J1.2), current_measurement (C1.2 R2.2 U1.3), voltage_measurement (5 pins), microcontroller (13 pins), UART (C26.2 U5.1 U5.7), power (7 pins), analog (8 pins)
GND-USB: UART (11 pins), USB-C_connector (9 pins)
VCC: main (J1.1), power (C32.1 U7.4 U7.8)
Alert: current_measurement (R4.2 U1.4), analog (R17.2 R18.2)
Alert-Fltr: microcontroller (U4.6), analog (C18.2 R17.1 U3.1 U3.2)
AMC-Diag: voltage_measurement (U2.14), microcontroller (U4.27)
current: current_measurement (U1.6), analog (U3.12)
D_N: UART (U6.16), USB-C_connector (U8.6)
D_P: UART (U6.15), USB-C_connector (U8.4)
in-curr: microcontroller (U4.13), analog (C19.1 R21.1)
in-volt: microcontroller (U4.15), analog (C15.1 R14.1)
NEG: main (MP3.1 MP4.1), voltage_measurement (10 pins)
OC: current_measurement (R3.2 U1.7), microcontroller (U4.28)
POS-IN: main (MP1.1), current_measurement (U1.2)
POS-OUT: main (MP2.1), current_measurement (U1.1), voltage_measurement (C2.1 R5.1)
USART1-Rx: microcontroller (U4.9), UART (R24.2)
USART1-Tx: microcontroller (U4.8), UART (R22.2)
volt_N: voltage_measurement (C14.1 R10.1), analog (R12.1)
volt_P: voltage_measurement (C14.2 R9.1), analog (R15.1)

## Assembly variants
Calibration: not fitted C? C? C? R?